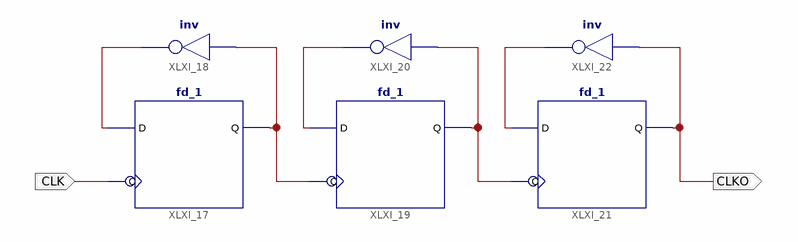
[diagram p0: schematic sheet 1]
// Xilinx ISE schematic clkdiv8.sch (spartan6) as structural Verilog: 6 symbols, 2 ports
module clkdiv8 (
  input  CLK,
  output CLKO
);

  wire XLXN_27, XLXN_28, XLXN_29, XLXN_9999, XLXN_10001;

  fd_1 XLXI_17 (.C(CLK), .D(XLXN_27), .Q(XLXN_9999));
  not XLXI_18 (XLXN_27, XLXN_9999);
  fd_1 XLXI_19 (.C(XLXN_9999), .D(XLXN_29), .Q(XLXN_28));
  not XLXI_20 (XLXN_29, XLXN_28);
  fd_1 XLXI_21 (.C(XLXN_28), .D(XLXN_10001), .Q(CLKO));
  not XLXI_22 (XLXN_10001, CLKO);
endmodule
